# EAGLE schematic TayDieuKhienWiFi_RF_n19_9_2019 (EAGLE 6.1)
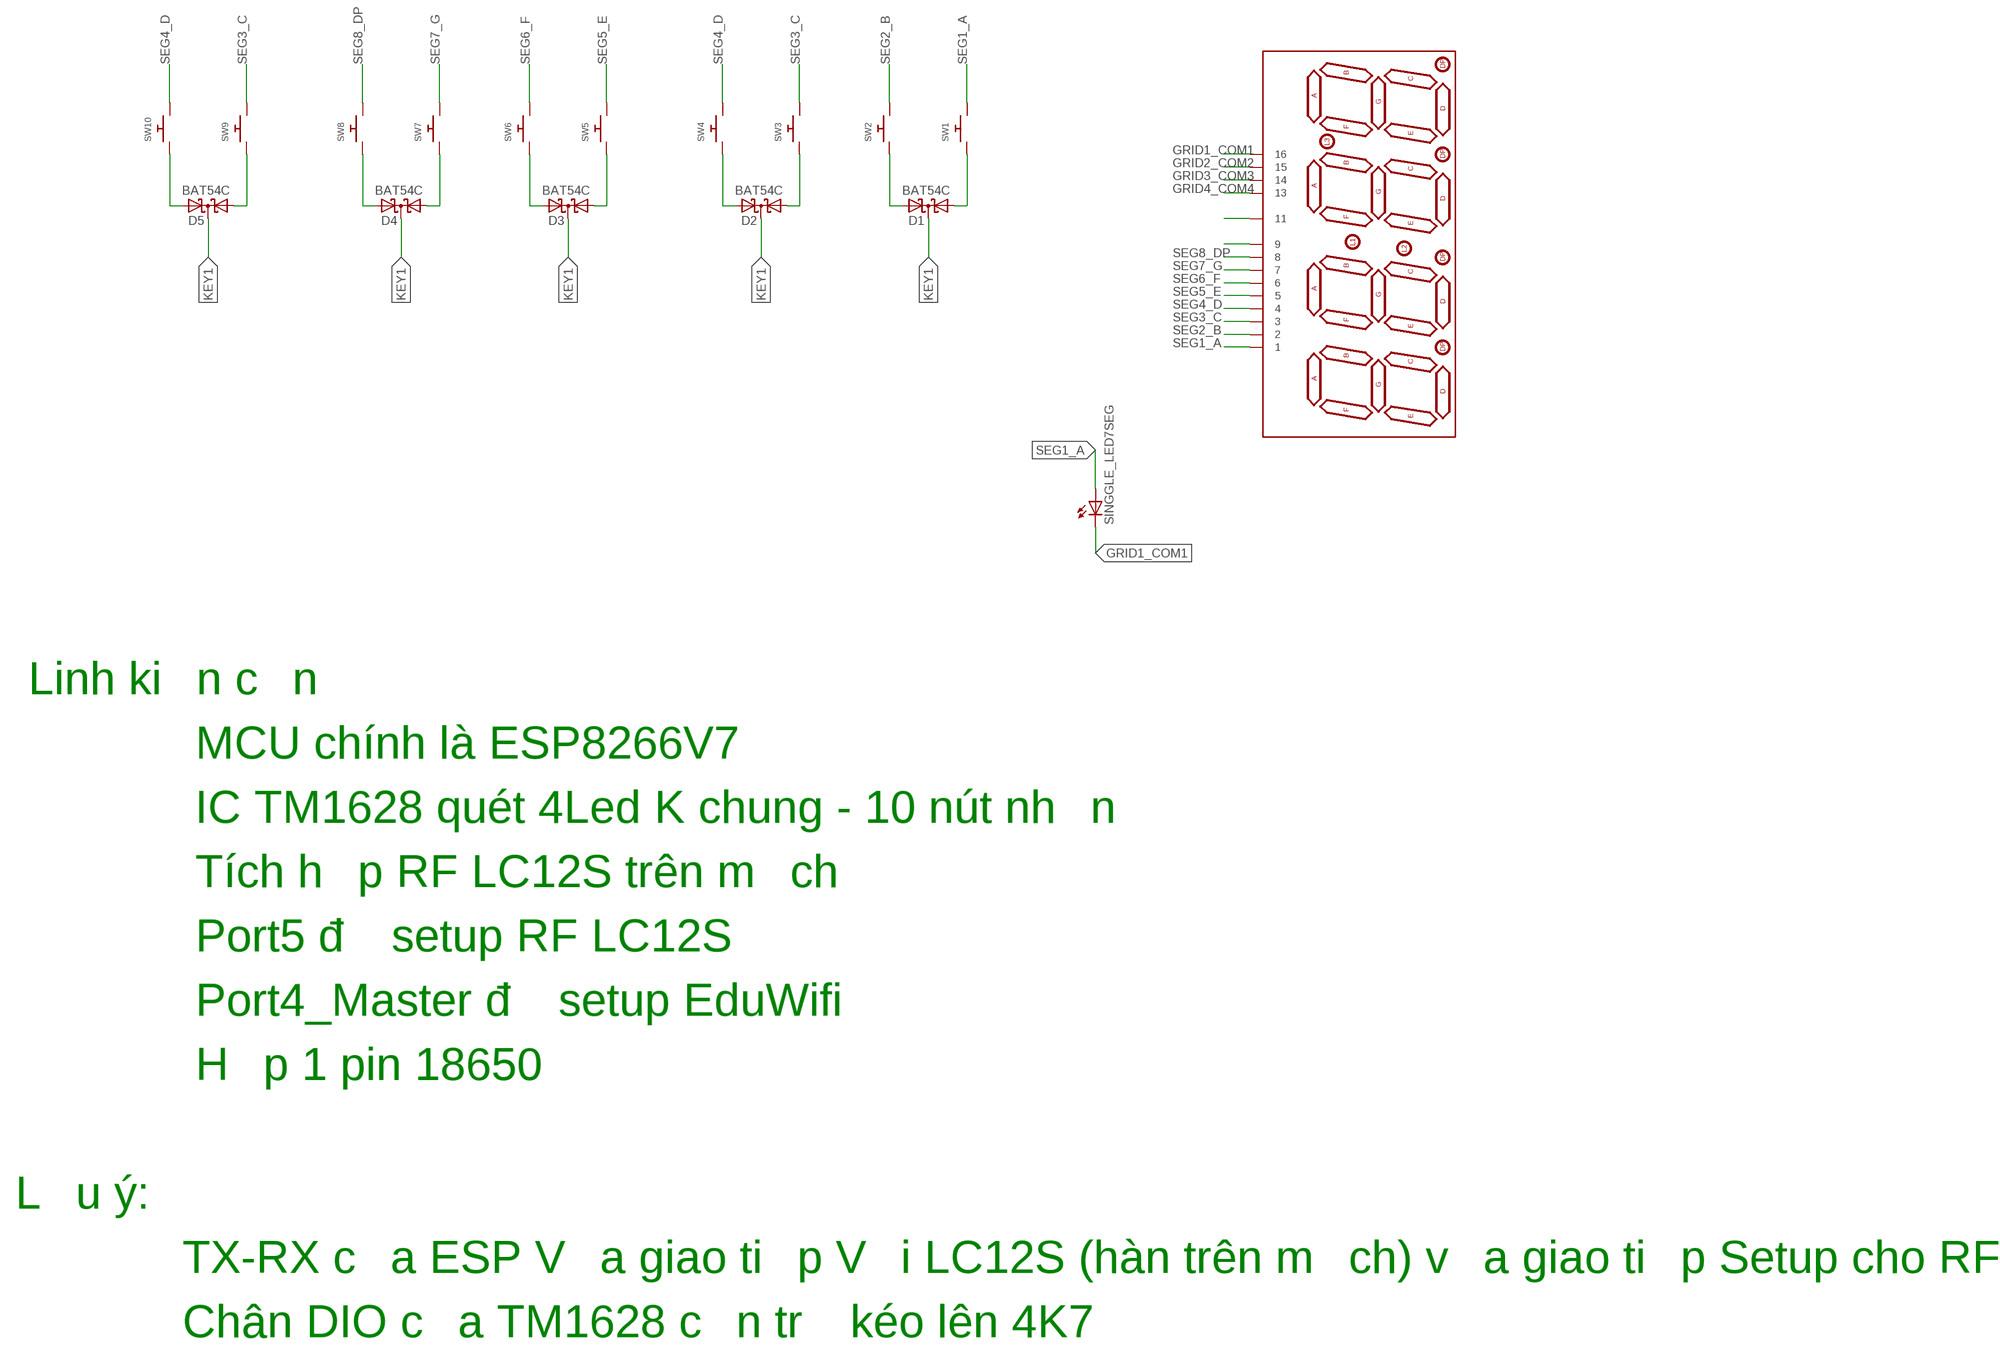
[diagram p0: schematic, sheet 1, part 1 of 2]
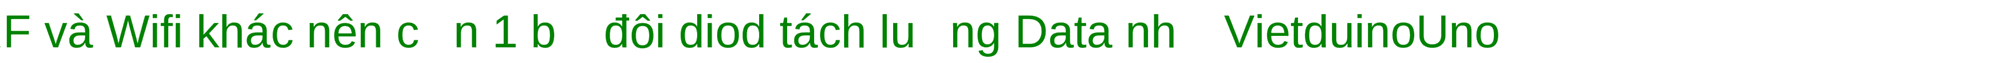
[diagram p1: schematic, sheet 1, part 2 of 2]

## Parts
D1  BAT54C  [SOT23]
D2  BAT54C  [SOT23]
D3  BAT54C  [SOT23]
D4  BAT54C  [SOT23]
D5  BAT54C  [SOT23]
SINGGLE_LED7SEG  LEDCHIP-LED0603  [CHIP-LED0603]
SW1  SWITCH_PUSHBUTTONC&K_KSS  [BTN_CK_KSS]
SW2  SWITCH_PUSHBUTTONC&K_KSS  [BTN_CK_KSS]
SW3  SWITCH_PUSHBUTTONC&K_KSS  [BTN_CK_KSS]
SW4  SWITCH_PUSHBUTTONC&K_KSS  [BTN_CK_KSS]
SW5  SWITCH_PUSHBUTTONC&K_KSS  [BTN_CK_KSS]
SW6  SWITCH_PUSHBUTTONC&K_KSS  [BTN_CK_KSS]
SW7  SWITCH_PUSHBUTTONC&K_KSS  [BTN_CK_KSS]
SW8  SWITCH_PUSHBUTTONC&K_KSS  [BTN_CK_KSS]
SW9  SWITCH_PUSHBUTTONC&K_KSS  [BTN_CK_KSS]
SW10  SWITCH_PUSHBUTTONC&K_KSS  [BTN_CK_KSS]
U$1  7-SEGMENT-4DIGIT  [7-SEGMENT-4DIGIT-YOUNGSUN]

## Nets
GRID1_COM1: SINGGLE_LED7SEG.C U$1.16
GRID2_COM2: U$1.15
GRID3_COM3: U$1.14
GRID4_COM4: U$1.13
KEY1: D1.3(CC) D2.3(CC) D3.3(CC) D4.3(CC) D5.3(CC)
N$1: D1.1(A1) SW1.P$1
N$2: D2.1(A1) SW3.P$1
N$3: D1.2(A2) SW2.P$1
N$4: D2.2(A2) SW4.P$1
N$5: D3.1(A1) SW5.P$1
N$6: D3.2(A2) SW6.P$1
N$7: D4.1(A1) SW7.P$1
N$8: D4.2(A2) SW8.P$1
N$9: U$1.9
N$10: U$1.11
N$11: D5.1(A1) SW9.P$1
N$12: D5.2(A2) SW10.P$1
SEG1_A: SINGGLE_LED7SEG.A SW1.P$2 U$1.1
SEG2_B: SW2.P$2 U$1.2
SEG3_C: SW3.P$2 SW9.P$2 U$1.3
SEG4_D: SW4.P$2 SW10.P$2 U$1.4
SEG5_E: SW5.P$2 U$1.5
SEG6_F: SW6.P$2 U$1.6
SEG7_G: SW7.P$2 U$1.7
SEG8_DP: SW8.P$2 U$1.8

## Notes on the sheet
- Linh kiện cần
- MCU chính là ESP8266V7
- IC TM1628 quét 4Led K chung - 10 nút nhấn
- Tích hợp RF LC12S trên mạch
- Port5 để setup RF LC12S
- Port4_Master để setup EduWifi
- Hộp 1 pin 18650
- Lưu ý:
- TX-RX của ESP Vừa giao tiếp Với LC12S (hàn trên mạch) vừa giao tiếp Setup cho RF và Wifi khác nên cần 1 bộ đôi diod tách luồng Data như VietduinoUno
- Chân DIO của TM1628 cần trở kéo lên 4K7

## Library data of the parts
D1-D5 = diode:BAT54C: Schottky Diodes Source: Fairchild .. BAT54.pdf
SINGGLE_LED7SEG = adafruit:LED: LED OSRAM: - CHIPLED LG R971, LG N971, LY N971, LG Q971, LY Q971, LO R971, LY R971 LH N974, LH R974 LS Q976, LO Q976, LY Q976 LO Q996 - Hyper CHIPLED LW Q18S LB Q993, LB Q99A, LB R99A - SideLED LS A670, LO A670, LY A670, LG A670, LP A670 LB A673, LV A673, LT A673, LW A673 LH A674 LY A675 LS A676, LA A676, LO A676, LY A676, LW A676 LS A679, LY A679, LG A679 - Hyper Micro SIDELED® LS Y876, LA Y876, LO Y876, LY Y876 LT Y87S - SmartLED LW L88C, LW L88S LB L89C, LB L89S, LG L890 LS L89K, LO L89K, LY L89K LS L896, LA L896, LO L896, LY L896 - TOPLED LS T670, LO T670, LY T670, LG T670, LP T670 LSG T670, LSP T670, LSY T670, LOP T670, LYG T670 LG T671, LOG T671, LSG T671 LB T673, LV T673, LT T673, LW T673 LH T674 LS T676, LA T676, LO T676, LY T676, LB T676, LH T676, LSB T676, LW T676 LB T67C, LV T67C, LT T67C, LS T67K, LO T67K, LY T67K, LW E67C LS E67B, LA E67B, LO E67B, LY E67B, LB E67C, LV E67C, LT E67C LW T67C LS T679, LY T679, LG T679 LS T770, LO T770, LY T770, LG T770, LP T770 LB T773, LV T773, LT T773, LW T773 LH T774 LS E675, LA E675, LY E675, LS T675 LS T776, LA T776, LO T776, LY T776, LB T776 LHGB T686 LT T68C, LB T68C - Hyper Mini TOPLED® LB M676 - Mini TOPLED Santana® LG M470 LS M47K, LO M47K, LY M47K Source: http://www.osram.convergy.de/
SW1-SW10 = adafruit:SWITCH_PUSHBUTTON: Buttons SOFTTOUCHSMD_SJ - Soft touch temporary push button (Super Junk Akihabara) Compatible with SKPMANE010 [Mouser: 688-SKPMAN] C&K_KSS = Digikey: KSS221GLFS
U$1 = SparkFun-Displays:7-SEGMENT-4DIGIT